# Altium project EEE20001 Lab Equipment.PrjPcb
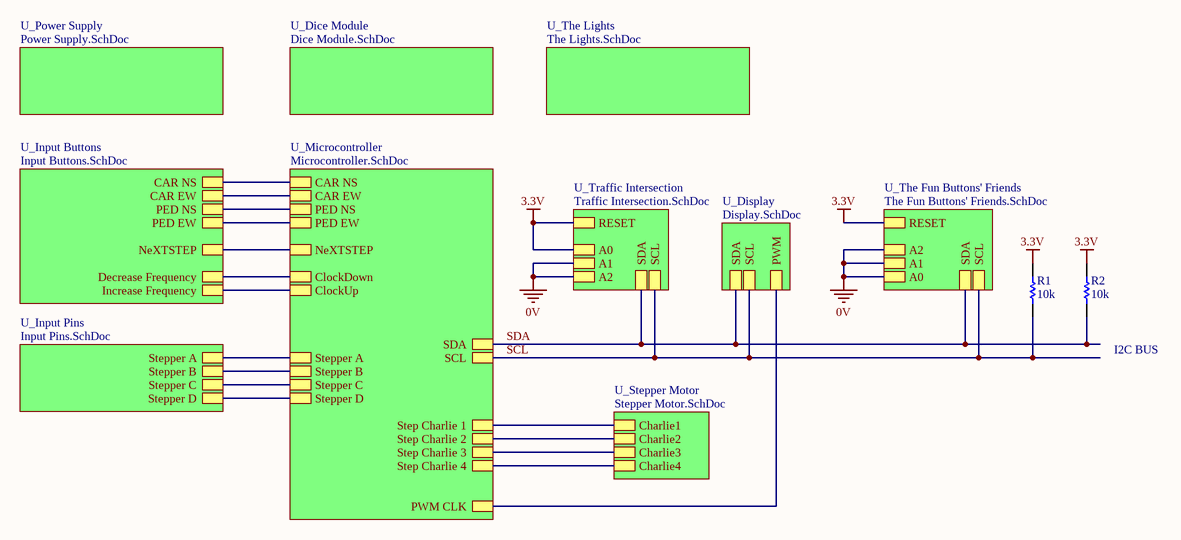
[diagram p0: 190822 Top Level.SchDoc]
11 sheets, 170 parts. Net scope: hierarchical (ports join the sheet entries above them; power ports are global).
Board file: 191015 PCB (REV0-1).PcbDoc
Sheets:
  190822 Top Level.SchDoc
    U_Power Supply = Power Supply.SchDoc
    U_Input Buttons = Input Buttons.SchDoc
    U_Input Pins = Input Pins.SchDoc
    U_Microcontroller = Microcontroller.SchDoc
    U_Traffic Intersection = Traffic Intersection.SchDoc
    U_Dice Module = Dice Module.SchDoc
    U_The Lights = The Lights.SchDoc
    U_Display = Display.SchDoc
    U_The Fun Buttons' Friends = The Fun Buttons' Friends.SchDoc
    U_Stepper Motor = Stepper Motor.SchDoc

## Sheet 190822 Top Level.SchDoc
size A4

### Parts
R1  10k  [0805]
R2  10k  [0805]

### Sub-sheets
U_Dice Module = Dice Module.SchDoc: no entries
U_Display = Display.SchDoc: SCL, SDA, PWM
U_Input Buttons = Input Buttons.SchDoc: CAR NS, CAR EW, PED NS, PED EW, NeXTSTEP, Decrease Frequency, Increase Frequency
U_Input Pins = Input Pins.SchDoc: Stepper D, Stepper C, Stepper B, Stepper A
U_Microcontroller = Microcontroller.SchDoc: SDA, SCL, CAR NS, CAR EW, PED NS, PED EW, Stepper A, Stepper B, Stepper C, Stepper D, Step Charlie 1, Step Charlie 2, Step Charlie 4, Step Charlie 3, PWM CLK, NeXTSTEP, ClockDown, ClockUp
U_Power Supply = Power Supply.SchDoc: no entries
U_Stepper Motor = Stepper Motor.SchDoc: Charlie1, Charlie2, Charlie3, Charlie4
U_The Fun Buttons' Friends = The Fun Buttons' Friends.SchDoc: SDA, SCL, RESET, A0, A1, A2
U_The Lights = The Lights.SchDoc: no entries
U_Traffic Intersection = Traffic Intersection.SchDoc: A0, A1, A2, RESET, SDA, SCL

### Nets
0V: sheet U_Traffic Intersection/A1, sheet U_Traffic Intersection/A2, sheet U_The Fun Buttons' Friends/A0, sheet U_The Fun Buttons' Friends/A1, sheet U_The Fun Buttons' Friends/A2
3.3V: R1.1 R2.1 ; sheet U_Traffic Intersection/A0, sheet U_Traffic Intersection/RESET, sheet U_The Fun Buttons' Friends/RESET
Charlie1: sheet U_Microcontroller/Step Charlie 1, sheet U_Stepper Motor/Charlie1
Charlie2: sheet U_Microcontroller/Step Charlie 2, sheet U_Stepper Motor/Charlie2
Charlie3: sheet U_Microcontroller/Step Charlie 3, sheet U_Stepper Motor/Charlie3
Charlie4: sheet U_Microcontroller/Step Charlie 4, sheet U_Stepper Motor/Charlie4
MISO: sheet U_Input Pins/Stepper C, sheet U_Microcontroller/Stepper C
MOSI: sheet U_Input Pins/Stepper D, sheet U_Microcontroller/Stepper D
SCL: R1.2 ; sheet U_Microcontroller/SCL, sheet U_Traffic Intersection/SCL, sheet U_Display/SCL, sheet U_The Fun Buttons' Friends/SCL
SDA: R2.2 ; sheet U_Microcontroller/SDA, sheet U_Traffic Intersection/SDA, sheet U_Display/SDA, sheet U_The Fun Buttons' Friends/SDA
Stepper A (IN): sheet U_Input Pins/Stepper A, sheet U_Microcontroller/Stepper A
Stepper B (IN): sheet U_Input Pins/Stepper B, sheet U_Microcontroller/Stepper B
NetBRUCE_SPRINGSTEEN1_1: sheet U_Input Buttons/Decrease Frequency, sheet U_Microcontroller/ClockDown
NetBRUCE_SPRINGSTEEN1_2: sheet U_Input Buttons/PED NS, sheet U_Microcontroller/PED NS
NetBRUCE_SPRINGSTEEN1_9: sheet U_Input Buttons/PED EW, sheet U_Microcontroller/PED EW
NetBRUCE_SPRINGSTEEN1_10: sheet U_Input Buttons/CAR NS, sheet U_Microcontroller/CAR NS
NetBRUCE_SPRINGSTEEN1_11: sheet U_Input Buttons/CAR EW, sheet U_Microcontroller/CAR EW
NetBRUCE_SPRINGSTEEN1_13: sheet U_Microcontroller/PWM CLK, sheet U_Display/PWM
NetBRUCE_SPRINGSTEEN1_30: sheet U_Input Buttons/NeXTSTEP, sheet U_Microcontroller/NeXTSTEP
NetBRUCE_SPRINGSTEEN1_32: sheet U_Input Buttons/Increase Frequency, sheet U_Microcontroller/ClockUp

### Notes on the sheet
- (near R2) I2C BUS
- Title
- Size:
- Date:
- A4
- Number:
- Time:
- Revision:
- Sheet
- of
- File:

### Library data of the parts
R1 R2 = RC0805FR0710KL: Manufacturer: YAGEO; Tolerance: 0.01; Rated Voltage: 0.125W; Part Number: RC0805FR0710KL; Value: 10k; Material: FR-07; qty: 50

## Sheet Power Supply.SchDoc
size A4
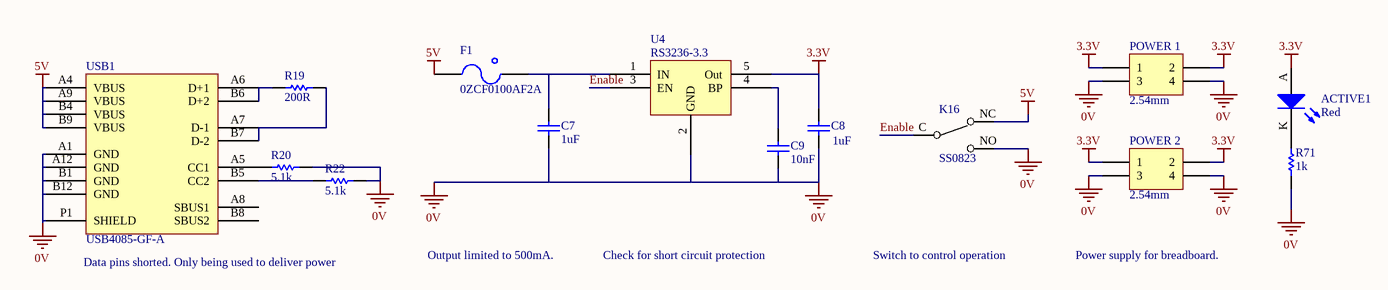
[diagram p1: Power Supply.SchDoc]

### Parts
ACTIVE1  Red  [0805 LED]
C7  1uF  [0805]
C8  1uF  [0805]
C9  10nF  [0805]
F1  0ZCF0100AF2A  [2920]
K16  SS0823  [Jaycar 2.54 SPDT Slide]
POWER_1  2.54mm  [Header 2x2]
POWER_2  2.54mm  [Header 2x2]
R19  200R  [0805]
R20  5.1k  [0805]
R22  5.1k  [0805]
R71  1k  [0805]
U4  RS3236-3.3  [Runic SOT-23-5]
USB1  USB4085-GF-A  [USB4085-GF-A]

### Nets
0V: C7.1 C8.1 C9.1 K16.NO POWER_1.3 POWER_1.4 POWER_2.3 POWER_2.4 R20.2 R22.2 R71.1 U4.2(GND) USB1.A1(GND) USB1.A12(GND) USB1.B1(GND) USB1.B12(GND) USB1.P1(SHIELD)
3.3V: ACTIVE1.A C8.2 POWER_1.1 POWER_1.2 POWER_2.1 POWER_2.2 U4.5(Out)
5V: F1.1 K16.NC USB1.A4(VBUS) USB1.A9(VBUS) USB1.B4(VBUS) USB1.B9(VBUS)
Enable: K16.C U4.3(EN)
NetACTIVE1_K: ACTIVE1.K R71.2
NetC7_2: C7.2 F1.2 U4.1(IN)
NetC9_2: C9.2 U4.4(BP)
NetR19_1: R19.1 USB1.A6(D+1) USB1.B6(D+2)
NetR19_2: R19.2 USB1.A7(D-1) USB1.B7(D-2)
NetR20_1: R20.1 USB1.A5(CC1)
NetR22_1: R22.1 USB1.B5(CC2)

Not connected (* = marked no-connect by the designer): USB1 A8(SBUS1) B8(SBUS2)

### Notes on the sheet
- (near USB1) Data pins shorted. Only being used to deliver power
- Output limited to 500mA.
- Check for short circuit protection
- Switch to control operation
- Power supply for breadboard.
- Title
- Size:
- Date:
- A4
- Number:
- Time:
- Revision:
- Sheet
- of
- File:

### Library data of the parts
ACTIVE1 = SML-210LTT86: Red LED Indication - Discrete 1.75V 0805 (2012 Metric); Manufacturer: ROHM Semiconductor; Part Number: SML-210LTT86; Colour: Red; Digikey Part Number: 511-1286-1-ND; Digikey Link: https://www.digikey.com/product-detail/en/rohm-semiconductor/SML-210LTT86/511-1286-1-ND/637099
C7 C8 = GCM21BR71A105KA37L: Manufacturer: muRata; Tolerance: 10%; Material: X7R; Rated Voltage: 10V; Part Number: GCM21BR71A105KA37L; Value: 1uF
C9 = GCM21BR71H103KA37L: Manufacturer: muRata; Tolerance: 10%; Material: X7R; Rated Voltage: 50V; Part Number: GCM21BR71H103KA37L; Value: 10nF
F1 = 0ZCF0100AF2A: PTC RESET FUSE 60V 1A 292; Manufacturer: Littelfuse Inc.; Part Number: 0ZCF0100AF2A; Digikey Part Number: 507-2070-1-ND; Digikey Link: https://www.digikey.com/product-detail/en/bel-fuse-inc/0ZCF0100AF2A/507-2070-1-ND/6210547
K16 = SS0823: SPDT Switch; Manufacturer: Jaycar; Part Number: SS0823; Digikey Link: https://www.jaycar.com.au/sub-miniature-dpdt-pcb-mount-switch/p/SS0823
POWER_1 POWER_2 = Header 2x2: Positions: 4; Angle: 0; Flange: No; Contact: NA; Part Number: Header 2x2; Pitch: 2.54mm; Row Spacing: 2.54mm
R19 = RC0805FR07200RL: Manufacturer: YAGEO; Tolerance: 0.01; Rated Voltage: 0.125W; Part Number: RC0805FR07200RL; Value: 200R; Material: FR-07; qty: 50
R20 R22 = RC0805FR075K1L: Manufacturer: YAGEO; Tolerance: 0.01; Rated Voltage: 0.125W; Part Number: RC0805FR075K1L; Value: 5.1k; Material: FR-07; qty: 50
R71 = RC0805FR071KL: Manufacturer: YAGEO; Tolerance: 0.01; Rated Voltage: 0.125W; Part Number: RC0805FR071KL; Value: 1k; Material: FR-07; qty: 50
U4 = RS3236-3.3: Low Power, Low Dropout, 500mA RF LinearRegulators; Manufacturer: RUNIC; Part Number: RS3236-3.3; Digikey Link: http://www.run-ic.com/Public/attached/file/201811/1542246949_88491.pdf
USB1 = USB4085-GF-A: USB - C (Type - C) USB 2.0 Receptacle Connector 16 Position Through Hole, Right Angle; Angle: 90; Part Number: USB4085-GF-A; Digikey Part Number: 2073-USB4085-GF-ACT-ND; Digikey Link: https://www.digikey.ee/product-detail/en/gct/USB4085-GF-A/2073-USB4085-GF-ACT-ND/9859733

## Sheet Input Buttons.SchDoc
size A4
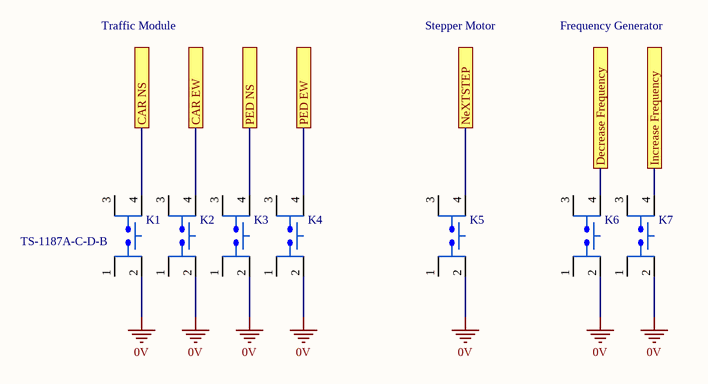
[diagram p2: Input Buttons.SchDoc]

### Parts
K1  TS-1187A-C-D-B  [XKB SW-4.5]
K2  TS-1187A-C-D-B  [XKB SW-4.5]  (value not drawn)
K3  TS-1187A-C-D-B  [XKB SW-4.5]  (value not drawn)
K4  TS-1187A-C-D-B  [XKB SW-4.5]  (value not drawn)
K5  TS-1187A-C-D-B  [XKB SW-4.5]  (value not drawn)
K6  TS-1187A-C-D-B  [XKB SW-4.5]  (value not drawn)
K7  TS-1187A-C-D-B  [XKB SW-4.5]  (value not drawn)

### Ports
CAR EW, CAR NS, Decrease Frequency, Increase Frequency, NeXTSTEP, PED EW, PED NS

### Nets
0V: K1.2(VDD) K2.2(VDD) K3.2(VDD) K4.2(VDD) K5.2(VDD) K6.2(VDD) K7.2(VDD)
NetBRUCE_SPRINGSTEEN1_1: K6.4(VDD) ; port Decrease Frequency
NetBRUCE_SPRINGSTEEN1_2: K3.4(VDD) ; port PED NS
NetBRUCE_SPRINGSTEEN1_9: K4.4(VDD) ; port PED EW
NetBRUCE_SPRINGSTEEN1_10: K1.4(VDD) ; port CAR NS
NetBRUCE_SPRINGSTEEN1_11: K2.4(VDD) ; port CAR EW
NetBRUCE_SPRINGSTEEN1_30: K5.4(VDD) ; port NeXTSTEP
NetBRUCE_SPRINGSTEEN1_32: K7.4(VDD) ; port Increase Frequency

Not connected (* = marked no-connect by the designer): K1 1(VDD) 3(VDD); K2 1(VDD) 3(VDD); K3 1(VDD) 3(VDD); K4 1(VDD) 3(VDD); K5 1(VDD) 3(VDD); K6 1(VDD) 3(VDD); K7 1(VDD) 3(VDD)

### Notes on the sheet
- Traffic Module
- Stepper Motor
- Frequency Generator
- Title
- Size:
- Date:
- A4
- Number:
- Time:
- Revision:
- Sheet
- of
- File:

### Library data of the parts
K1-K7 = TS-1187A-C-D-B: TACTILE SWITCHES SPST 5.10MM X 5.10MM 0.80MM SMD ROHS; Manufacturer: XKB Enerprise; Part Number: TS-1187A-C-D-B; Digikey Link: https://jlcpcb.com/client/index.html#/parts/componentSearch?searchTxt=usb

## Sheet Input Pins.SchDoc
size A4
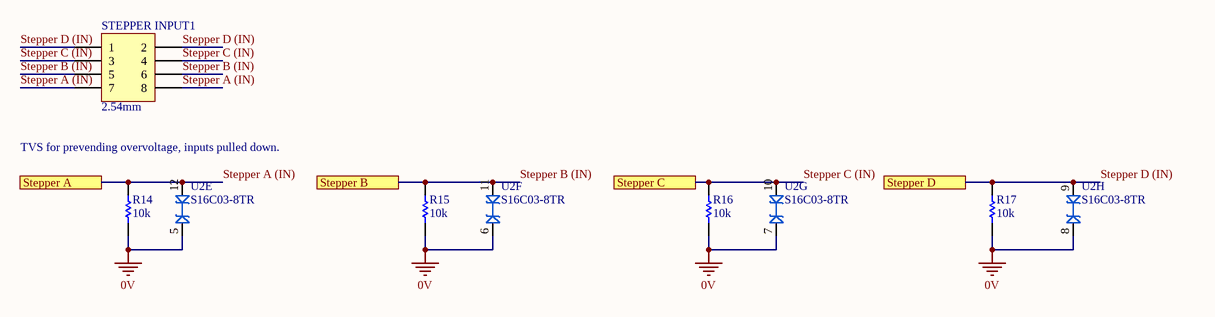
[diagram p3: Input Pins.SchDoc]

### Parts
R14  10k  [0805]
R15  10k  [0805]
R16  10k  [0805]
R17  10k  [0805]
STEPPER_INPUT1  2.54mm  [Header 2x4]
U2  S16C03-8TR  [SMC 16-SOIC]  (parts E,F,G,H of 8)

### Ports
Stepper A, Stepper B, Stepper C, Stepper D

### Nets
0V: R14.1 R15.1 R16.1 R17.1 U2.5(A) U2.6(A) U2.7(A) U2.8(A)
Stepper A (IN): R14.2 STEPPER_INPUT1.7 STEPPER_INPUT1.8 U2.12(A) ; port Stepper A
Stepper B (IN): R15.2 STEPPER_INPUT1.5 STEPPER_INPUT1.6 U2.11(A) ; port Stepper B
Stepper C (IN): R16.2 STEPPER_INPUT1.3 STEPPER_INPUT1.4 U2.10(A) ; port Stepper C  [project net MISO]
Stepper D (IN): R17.2 STEPPER_INPUT1.1 STEPPER_INPUT1.2 U2.9(A) ; port Stepper D  [project net MOSI]

### Notes on the sheet
- TVS for prevending overvoltage, inputs pulled down.
- Title
- Size:
- Date:
- A4
- Number:
- Time:
- Revision:
- Sheet
- of
- File:

### Library data of the parts
R14-R17 = RC0805FR0710KL: as R1 on sheet 190822 Top Level; Part Number: RC0805FR0710KL; Value: 10k; Material: FR-07; qty: 50
STEPPER_INPUT1 = Header 2x4: Positions: 8; Angle: 0; Flange: No; Contact: NA; Part Number: Header 2x4; Pitch: 2.54mm; Row Spacing: 2.54mm
U2 = S16C03-8TR: PD 300W VWM 3.3VCJ 425PFPACKAGE; Manufacturer: SMC Diode; Part Number: S16C03-8TR; Digikey Part Number: 1655-2152-2-ND; Digikey Link: https://www.digikey.com/product-detail/en/smc-diode-solutions/S16C03-8TR/1655-2152-2-ND/9816814

## Sheet Microcontroller.SchDoc
size A4
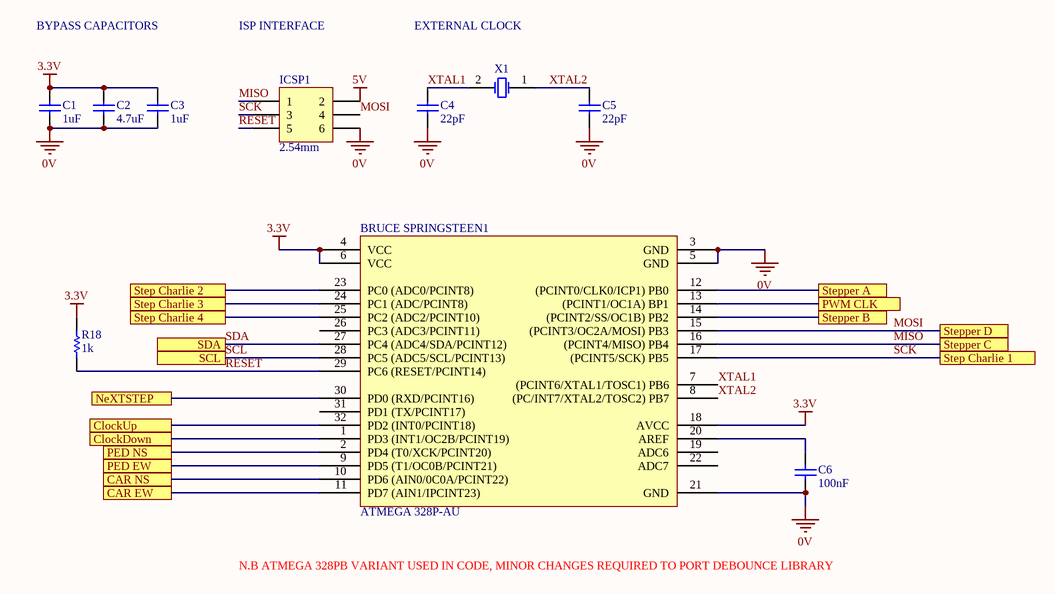
[diagram p4: Microcontroller.SchDoc]

### Parts
BRUCE_SPRINGSTEEN1  ATMEGA 328P-AU  [ATMEL TQFP-32]
C1  1uF  [0805]
C2  4.7uF  [0805]
C3  1uF  [0805]
C4  22pF  [0805]
C5  22pF  [0805]
C6  100nF  [0805]
ICSP1  2.54mm  [Header 2x3]
R18  1k  [0805]
X1  (no value)  [Abracon HC-49/US]

### Ports
CAR EW, CAR NS, ClockDown, ClockUp, NeXTSTEP, PED EW, PED NS, PWM CLK, SCL, SDA, Step Charlie 1, Step Charlie 2, Step Charlie 3, Step Charlie 4, Stepper A, Stepper B, Stepper C, Stepper D

### Nets
0V: BRUCE_SPRINGSTEEN1.3(GND) BRUCE_SPRINGSTEEN1.5(GND) BRUCE_SPRINGSTEEN1.21(GND) C1.1 C2.1 C3.1 C4.1 C5.1 C6.1 ICSP1.6
3.3V: BRUCE_SPRINGSTEEN1.4(VCC) BRUCE_SPRINGSTEEN1.6(VCC) BRUCE_SPRINGSTEEN1.18(AVCC) C1.2 C2.2 C3.2 R18.2
5V: ICSP1.2
Charlie2: BRUCE_SPRINGSTEEN1.23(PC0_(ADC0/PCINT8)) ; port Step Charlie 2
Charlie3: BRUCE_SPRINGSTEEN1.24(PC1_(ADC/PCINT8)) ; port Step Charlie 3
Charlie4: BRUCE_SPRINGSTEEN1.25(PC2_(ADC2/PCINT10)) ; port Step Charlie 4
MISO: BRUCE_SPRINGSTEEN1.16((PCINT4/MISO)_PB4) ICSP1.1 ; port Stepper C
MOSI: BRUCE_SPRINGSTEEN1.15((PCINT3/OC2A/MOSI)_PB3) ICSP1.4 ; port Stepper D
RESET: BRUCE_SPRINGSTEEN1.29(PC6_(RESET/PCINT14)) ICSP1.5 R18.1
SCK: BRUCE_SPRINGSTEEN1.17((PCINT5/SCK)_PB5) ICSP1.3 ; port Step Charlie 1  [project net Charlie1]
SCL: BRUCE_SPRINGSTEEN1.28(PC5_(ADC5/SCL/PCINT13)) ; port SCL
SDA: BRUCE_SPRINGSTEEN1.27(PC4_(ADC4/SDA/PCINT12)) ; port SDA
Stepper A (IN): BRUCE_SPRINGSTEEN1.12((PCINT0/CLK0/ICP1)_PB0) ; port Stepper A
Stepper B (IN): BRUCE_SPRINGSTEEN1.14((PCINT2/SS/OC1B)_PB2) ; port Stepper B
XTAL1: BRUCE_SPRINGSTEEN1.7((PCINT6/XTAL1/TOSC1)_PB6) C4.2 X1.2(OSC2)
XTAL2: BRUCE_SPRINGSTEEN1.8((PC/INT7/XTAL2/TOSC2)_PB7) C5.2 X1.1(OSC1)
NetBRUCE_SPRINGSTEEN1_1: BRUCE_SPRINGSTEEN1.1(PD3_(INT1/OC2B/PCINT19)) ; port ClockDown
NetBRUCE_SPRINGSTEEN1_2: BRUCE_SPRINGSTEEN1.2(PD4_(T0/XCK/PCINT20)) ; port PED NS
NetBRUCE_SPRINGSTEEN1_9: BRUCE_SPRINGSTEEN1.9(PD5_(T1/OC0B/PCINT21)) ; port PED EW
NetBRUCE_SPRINGSTEEN1_10: BRUCE_SPRINGSTEEN1.10(PD6_(AIN0/0C0A/PCINT22)) ; port CAR NS
NetBRUCE_SPRINGSTEEN1_11: BRUCE_SPRINGSTEEN1.11(PD7_(AIN1/IPCINT23)) ; port CAR EW
NetBRUCE_SPRINGSTEEN1_13: BRUCE_SPRINGSTEEN1.13((PCINT1/OC1A)_BP1) ; port PWM CLK
NetBRUCE_SPRINGSTEEN1_20: BRUCE_SPRINGSTEEN1.20(AREF) C6.2
NetBRUCE_SPRINGSTEEN1_30: BRUCE_SPRINGSTEEN1.30(PD0_(RXD/PCINT16)) ; port NeXTSTEP
NetBRUCE_SPRINGSTEEN1_32: BRUCE_SPRINGSTEEN1.32(PD2_(INT0/PCINT18)) ; port ClockUp

Not connected (* = marked no-connect by the designer): BRUCE_SPRINGSTEEN1 19(ADC6) 22(ADC7) 26(PC3_(ADC3/PCINT11)) 31(PD1_(TX/PCINT17))

### Notes on the sheet
- BYPASS CAPACITORS
- ISP INTERFACE
- EXTERNAL CLOCK
- N.B ATMEGA 328PB VARIANT USED IN CODE, MINOR CHANGES REQUIRED TO PORT DEBOUNCE LIBRARY
- Title
- Size:
- Date:
- A4
- Number:
- Time:
- Revision:
- Sheet
- of
- File:

### Library data of the parts
BRUCE_SPRINGSTEEN1 = ATMEGA 328P-AU: AVR AVR® ATmega Microcontroller IC 8-Bit 20MHz 32KB (16K x 16) FLASH 32-TQFP (7x7); Manufacturer: ATMEL; Part Number: ATMEGA 328P-AU; Digikey Part Number: ATMEGA328P-AU-ND; Digikey Link: https://www.digikey.com/product-detail/en/microchip-technology/ATMEGA328P-AU/ATMEGA328P-AU-ND/1832260
C1 C3 = GCM21BR71A105KA37L: as C7 on sheet Power Supply; Part Number: GCM21BR71A105KA37L; Value: 1uF
C2 = GCM21BR61A475KA37L: Manufacturer: muRata; Tolerance: 10%; Material: X5R; Rated Voltage: 10V; Part Number: GCM21BR61A475KA37L; Value: 4.7uF
C4 C5 = GCM21B5C1H220JA37L: Manufacturer: muRata; Tolerance: 5%; Material: C0G; Rated Voltage: 50V; Part Number: GCM21B5C1H220JA37L; Value: 22pF
C6 = GCM21BR71E104KA37L: Manufacturer: muRata; Tolerance: 10%; Material: X7R; Rated Voltage: 25V; Part Number: GCM21BR71E104KA37L; Value: 100nF
ICSP1 = Header 2x3: Positions: 6; Angle: 0; Flange: No; Contact: NA; Part Number: Header 2x3; Pitch: 2.54mm; Row Spacing: 2.54mm
R18 = RC0805FR071KL: as R71 on sheet Power Supply; Part Number: RC0805FR071KL; Value: 1k; Material: FR-07; qty: 50
X1 = ABLS-16.000MHZ-B4-T: Manufacturer: Abracon LLC; Load Capacitance: 18pF; ESR: 40R; Part Number: ABLS-16.000MHZ-B4-T; Digikey Part Number: 535-10226-1-ND; Digikey Link: https://www.digikey.com/product-detail/en/abracon-llc/ABLS-16.000MHZ-B4-T/535-10226-1-ND/2184261

## Sheet Traffic Intersection.SchDoc
size A4
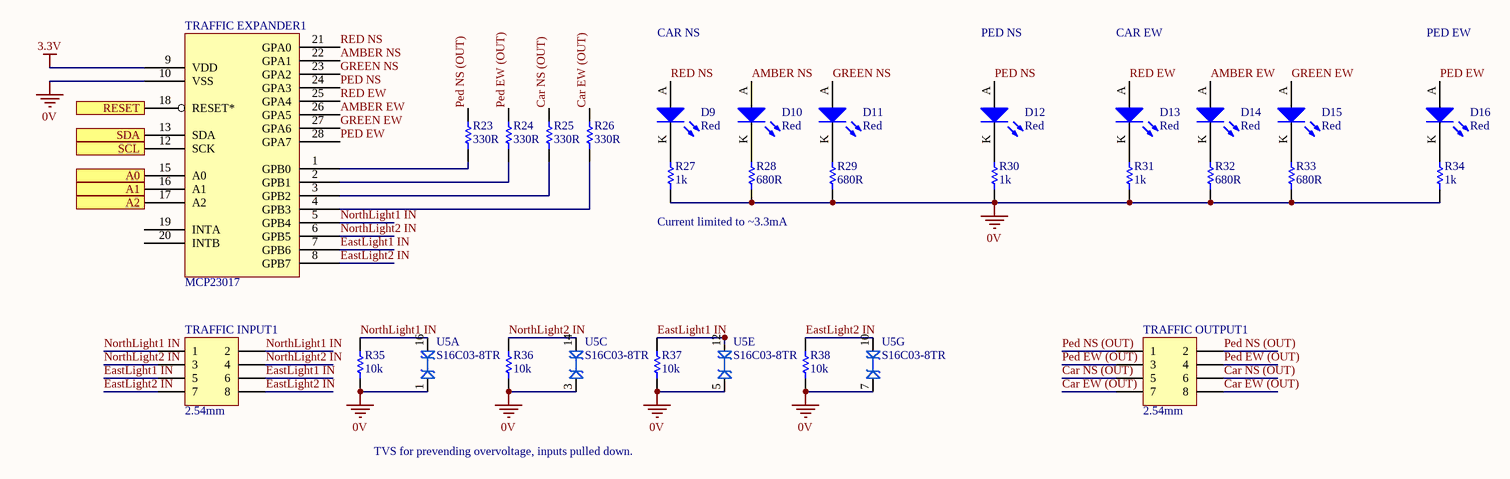
[diagram p5: Traffic Intersection.SchDoc]

### Parts
D9  Red  [0805 LED]
D10  Red  [0805 LED]
D11  Red  [0805 LED]
D12  Red  [0805 LED]
D13  Red  [0805 LED]
D14  Red  [0805 LED]
D15  Red  [0805 LED]
D16  Red  [0805 LED]
R23  330R  [0805]
R24  330R  [0805]
R25  330R  [0805]
R26  330R  [0805]
R27  1k  [0805]
R28  680R  [0805]
R29  680R  [0805]
R30  1k  [0805]
R31  1k  [0805]
R32  680R  [0805]
R33  680R  [0805]
R34  1k  [0805]
R35  10k  [0805]
R36  10k  [0805]
R37  10k  [0805]
R38  10k  [0805]
TRAFFIC_EXPANDER1  MCP23017  [Microchip 28-SOIC]
TRAFFIC_INPUT1  2.54mm  [Header 2x4]
TRAFFIC_OUTPUT1  2.54mm  [Header 2x4]
U5  S16C03-8TR  [SMC 16-SOIC]  (parts A,C,E,G of 8)

### Ports
A0, A1, A2, RESET, SCL, SDA

### Nets
0V: R27.1 R28.1 R29.1 R30.1 R31.1 R32.1 R33.1 R34.1 R35.1 R36.1 R37.1 R38.1 TRAFFIC_EXPANDER1.10(VSS) TRAFFIC_EXPANDER1.16(A1) TRAFFIC_EXPANDER1.17(A2) U5.1(A) U5.3(A) U5.5(A) U5.7(A) ; port A1, port A2
3.3V: TRAFFIC_EXPANDER1.9(VDD) TRAFFIC_EXPANDER1.15(A0) TRAFFIC_EXPANDER1.18(RESET*) ; port A0, port RESET
AMBER EW: D14.A TRAFFIC_EXPANDER1.26(GPA5)
AMBER NS: D10.A TRAFFIC_EXPANDER1.22(GPA1)
Car EW (OUT): R26.2 TRAFFIC_OUTPUT1.7 TRAFFIC_OUTPUT1.8
Car NS (OUT): R25.2 TRAFFIC_OUTPUT1.5 TRAFFIC_OUTPUT1.6
EastLight1 IN: R37.2 TRAFFIC_EXPANDER1.7(GPB6) TRAFFIC_INPUT1.5 TRAFFIC_INPUT1.6 U5.12(A)
EastLight2 IN: R38.2 TRAFFIC_EXPANDER1.8(GPB7) TRAFFIC_INPUT1.7 TRAFFIC_INPUT1.8 U5.10(A)
GREEN EW: D15.A TRAFFIC_EXPANDER1.27(GPA6)
GREEN NS: D11.A TRAFFIC_EXPANDER1.23(GPA2)
NorthLight1 IN: R35.2 TRAFFIC_EXPANDER1.5(GPB4) TRAFFIC_INPUT1.1 TRAFFIC_INPUT1.2 U5.16(A)
NorthLight2 IN: R36.2 TRAFFIC_EXPANDER1.6(GPB5) TRAFFIC_INPUT1.3 TRAFFIC_INPUT1.4 U5.14(A)
PED EW: D16.A TRAFFIC_EXPANDER1.28(GPA7)
Ped EW (OUT): R24.2 TRAFFIC_OUTPUT1.3 TRAFFIC_OUTPUT1.4
PED NS: D12.A TRAFFIC_EXPANDER1.24(GPA3)
Ped NS (OUT): R23.2 TRAFFIC_OUTPUT1.1 TRAFFIC_OUTPUT1.2
RED EW: D13.A TRAFFIC_EXPANDER1.25(GPA4)
RED NS: D9.A TRAFFIC_EXPANDER1.21(GPA0)
SCL: TRAFFIC_EXPANDER1.12(SCK) ; port SCL
SDA: TRAFFIC_EXPANDER1.13(SDA) ; port SDA
NetD9_K: D9.K R27.2
NetD10_K: D10.K R28.2
NetD11_K: D11.K R29.2
NetD12_K: D12.K R30.2
NetD13_K: D13.K R31.2
NetD14_K: D14.K R32.2
NetD15_K: D15.K R33.2
NetD16_K: D16.K R34.2
NetR23_1: R23.1 TRAFFIC_EXPANDER1.1(GPB0)
NetR24_1: R24.1 TRAFFIC_EXPANDER1.2(GPB1)
NetR25_1: R25.1 TRAFFIC_EXPANDER1.3(GPB2)
NetR26_1: R26.1 TRAFFIC_EXPANDER1.4(GPB3)

Not connected (* = marked no-connect by the designer): TRAFFIC_EXPANDER1 19(INTA) 20(INTB)

### Notes on the sheet
- CAR NS
- PED NS
- CAR EW
- PED EW
- Current limited to ~3.3mA
- TVS for prevending overvoltage, inputs pulled down.
- Title
- Size:
- Date:
- A4
- Number:
- Time:
- Revision:
- Sheet
- of
- File:

### Library data of the parts
D9 D13 = SML-210LTT86: as ACTIVE1 on sheet Power Supply; Part Number: SML-210LTT86; Colour: Red; Digikey Part Number: 511-1286-1-ND; Digikey Link: https://www.digikey.com/product-detail/en/rohm-semiconductor/SML-210LTT86/511-1286-1-ND/637099
D10 D14 = SML-211DTT86: Orange LED Indication - Discrete 1.75V 0805 (2012 Metric); Manufacturer: ROHM Semiconductor; Part Number: SML-211DTT86; Colour: Red; Digikey Part Number: 511-1291-1-ND; Digikey Link: https://www.digikey.com/product-detail/en/rohm-semiconductor/SML-211DTT86/511-1291-1-ND/637104
D11 D12 D15 D16 = SML-210FTT86: Green LED Indication - Discrete 1.75V 0805 (2012 Metric); Manufacturer: ROHM Semiconductor; Part Number: SML-210FTT86; Colour: Red; Digikey Part Number: 511-1285-1-ND; Digikey Link: https://www.digikey.com/product-detail/en/rohm-semiconductor/SML-210FTT86/511-1285-1-ND/637098
R23-R26 = RC0805FR07330RL: Manufacturer: YAGEO; Tolerance: 0.01; Rated Voltage: 0.125W; Part Number: RC0805FR07330RL; Value: 330R; Material: FR-07; qty: 50
R27 R30 R31 R34 = RC0805FR071KL: as R71 on sheet Power Supply; Part Number: RC0805FR071KL; Value: 1k; Material: FR-07; qty: 50
R28 R29 R32 R33 = RC0805FR07680RL: Manufacturer: YAGEO; Tolerance: 0.01; Rated Voltage: 0.125W; Part Number: RC0805FR07680RL; Value: 680R; Material: FR-07; qty: 50
R35-R38 = RC0805FR0710KL: as R1 on sheet 190822 Top Level; Part Number: RC0805FR0710KL; Value: 10k; Material: FR-07; qty: 50
TRAFFIC_EXPANDER1 = MCP23017: IC I/O EXPANDER I2C 16B 28SOIC; Manufacturer: Microchip Technology; Part Number: MCP23017; Digikey Part Number: MCP23017T-E/SOTR-ND; Digikey Link: https://www.digikey.com/product-detail/en/microchip-technology/MCP23017T-E-SO/MCP23017T-E-SOTR-ND/964184
TRAFFIC_INPUT1 TRAFFIC_OUTPUT1 = Header 2x4: as STEPPER_INPUT1 on sheet Input Pins; Part Number: Header 2x4; Pitch: 2.54mm; Row Spacing: 2.54mm
U5 = S16C03-8TR: as U2 on sheet Input Pins; Part Number: S16C03-8TR; Digikey Part Number: 1655-2152-2-ND; Digikey Link: https://www.digikey.com/product-detail/en/smc-diode-solutions/S16C03-8TR/1655-2152-2-ND/9816814

## Sheet Dice Module.SchDoc
size A4
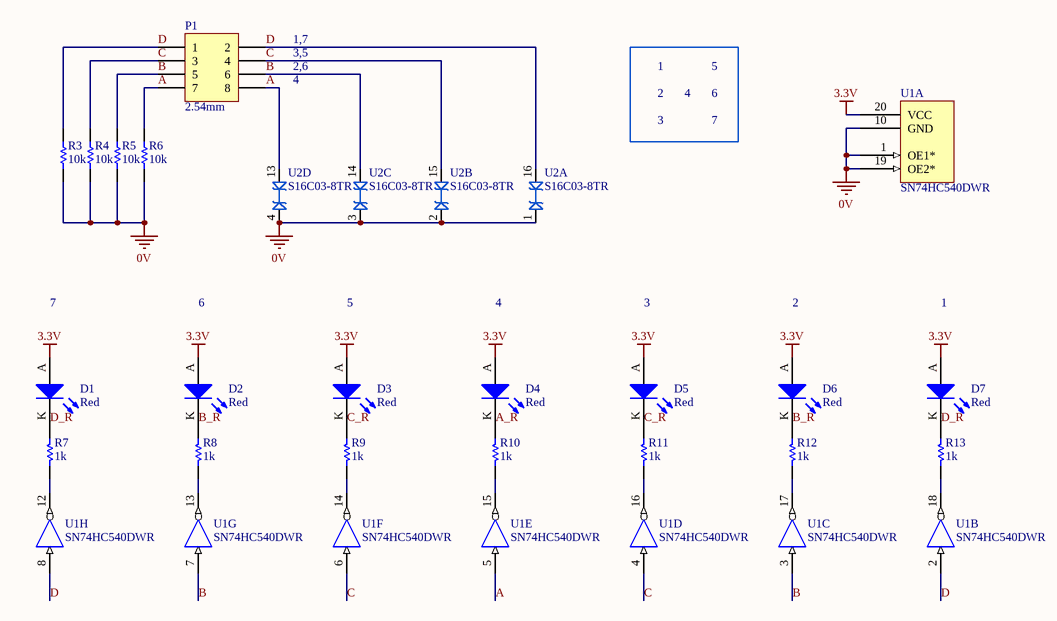
[diagram p6: Dice Module.SchDoc]

### Parts
D1  Red  [0805 LED]
D2  Red  [0805 LED]
D3  Red  [0805 LED]
D4  Red  [0805 LED]
D5  Red  [0805 LED]
D6  Red  [0805 LED]
D7  Red  [0805 LED]
P1  2.54mm  [Header 2x4]
R3  10k  [0805]
R4  10k  [0805]
R5  10k  [0805]
R6  10k  [0805]
R7  1k  [0805]
R8  1k  [0805]
R9  1k  [0805]
R10  1k  [0805]
R11  1k  [0805]
R12  1k  [0805]
R13  1k  [0805]
U1  SN74HC540DWR  [TI 20-SOIC]  (parts A,B,C,D,E,F,G,H of 9)
U2  S16C03-8TR  [SMC 16-SOIC]  (parts A,B,C,D of 8)

### Nets
0V: R3.1 R4.1 R5.1 R6.1 U1.1(OE1*) U1.10(GND) U1.19(OE2*) U2.1(A) U2.2(A) U2.3(A) U2.4(A)
3.3V: D1.A D2.A D3.A D4.A D5.A D6.A D7.A U1.20(VCC)
A: P1.7 P1.8 R6.2 U1.5(A4) U2.13(A)
A_R: D4.K R10.1
B: P1.5 P1.6 R5.2 U1.3(A2) U1.7(A6) U2.14(A)
B_R: D2.K D6.K R8.1 R12.1
C: P1.3 P1.4 R4.2 U1.4(A3) U1.6(A5) U2.15(A)
C_R: D3.K D5.K R9.1 R11.1
D: P1.1 P1.2 R3.2 U1.2(A1) U1.8(A7) U2.16(A)
D_R: D1.K D7.K R7.1 R13.1
NetR7_2: R7.2 U1.12(Y7)
NetR8_2: R8.2 U1.13(Y6)
NetR9_2: R9.2 U1.14(Y5)
NetR10_2: R10.2 U1.15(Y5)
NetR11_2: R11.2 U1.16(Y3)
NetR12_2: R12.2 U1.17(Y2)
NetR13_2: R13.2 U1.18(Y1)

### Notes on the sheet
- 1,7
- 3,5
- 2,6
- 4
- 1
- 2
- 5
- 6
- 3
- 7
- Title
- Size:
- Date:
- A4
- Number:
- Time:
- Revision:
- Sheet
- of
- File:

### Library data of the parts
D1-D7 = SML-210LTT86: as ACTIVE1 on sheet Power Supply; Part Number: SML-210LTT86; Colour: Red; Digikey Part Number: 511-1286-1-ND; Digikey Link: https://www.digikey.com/product-detail/en/rohm-semiconductor/SML-210LTT86/511-1286-1-ND/637099
P1 = Header 2x4: as STEPPER_INPUT1 on sheet Input Pins; Part Number: Header 2x4; Pitch: 2.54mm; Row Spacing: 2.54mm
R3-R6 = RC0805FR0710KL: as R1 on sheet 190822 Top Level; Part Number: RC0805FR0710KL; Value: 10k; Material: FR-07; qty: 50
R7-R13 = RC0805FR071KL: as R71 on sheet Power Supply; Part Number: RC0805FR071KL; Value: 1k; Material: FR-07; qty: 50
U1 = SN74HC540DWR: IC BUFFER INVERT 6V 20SOIC; Manufacturer: Texas Instruments; Part Number: SN74HC540DWR; Digikey Part Number: 296-8333-1-ND; Digikey Link: https://www.digikey.com/product-detail/en/texas-instruments/SN74HC540DWR/296-8333-1-ND/376710
U2 = S16C03-8TR: as U2 on sheet Input Pins; Part Number: S16C03-8TR; Digikey Part Number: 1655-2152-2-ND; Digikey Link: https://www.digikey.com/product-detail/en/smc-diode-solutions/S16C03-8TR/1655-2152-2-ND/9816814

## Sheet The Lights.SchDoc
size A4
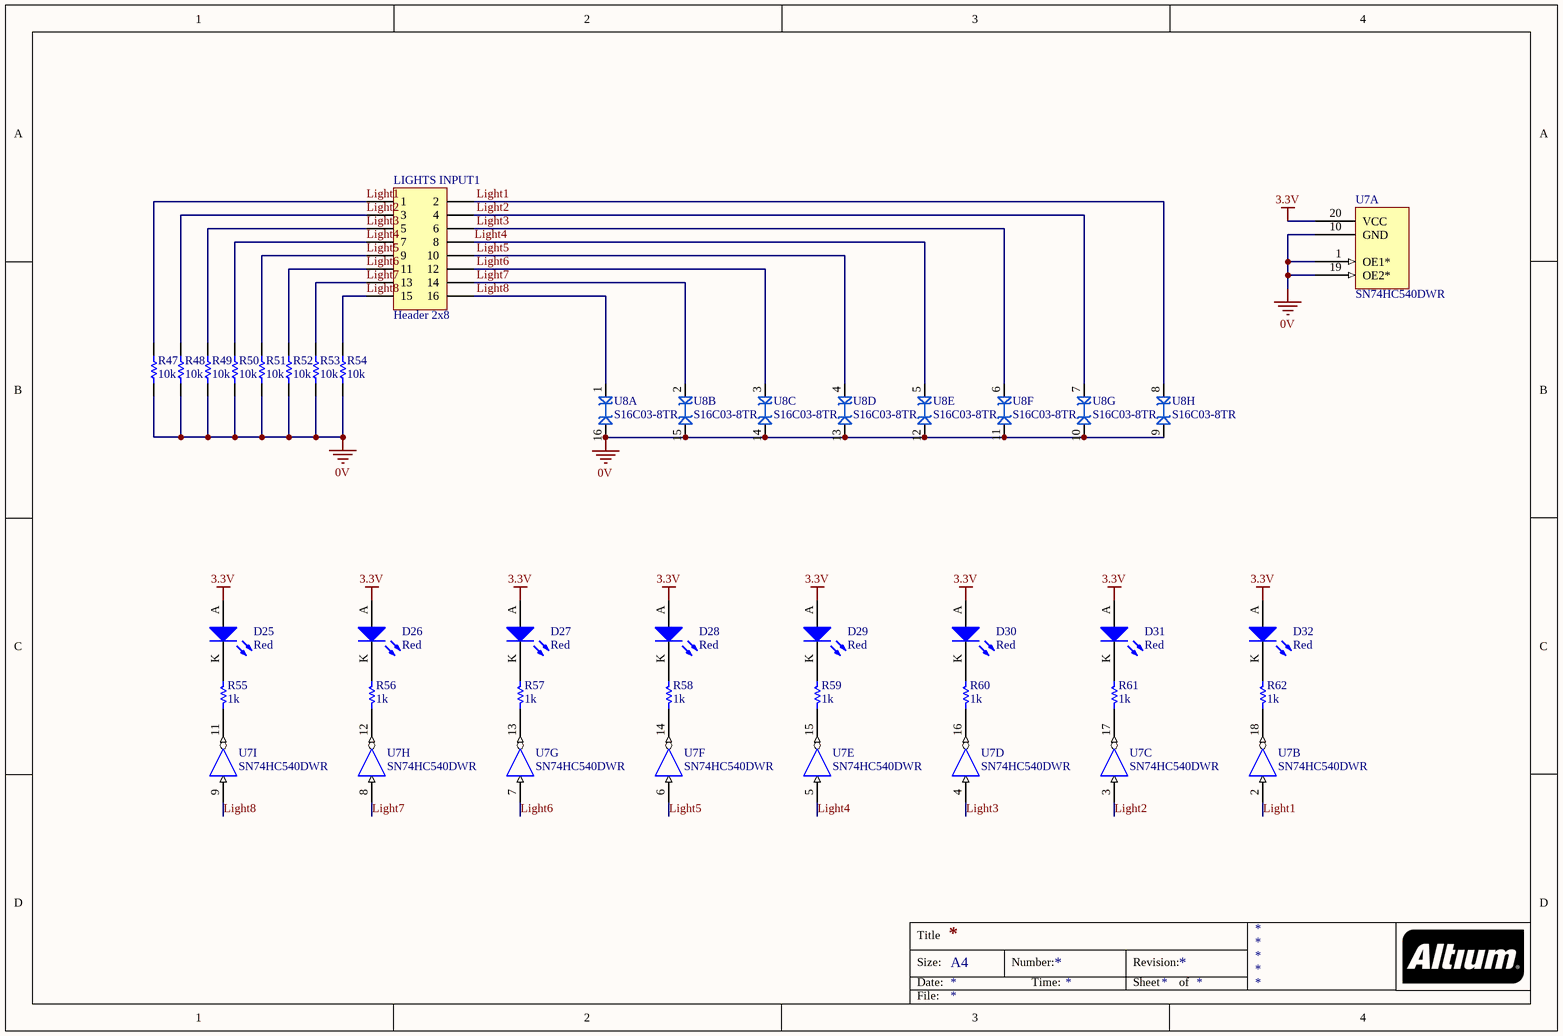
[diagram p7: The Lights.SchDoc]

### Parts
D25  Red  [0805 LED]
D26  Red  [0805 LED]
D27  Red  [0805 LED]
D28  Red  [0805 LED]
D29  Red  [0805 LED]
D30  Red  [0805 LED]
D31  Red  [0805 LED]
D32  Red  [0805 LED]
LIGHTS_INPUT1  Header 2x8  [Header 2x8]
R47  10k  [0805]
R48  10k  [0805]
R49  10k  [0805]
R50  10k  [0805]
R51  10k  [0805]
R52  10k  [0805]
R53  10k  [0805]
R54  10k  [0805]
R55  1k  [0805]
R56  1k  [0805]
R57  1k  [0805]
R58  1k  [0805]
R59  1k  [0805]
R60  1k  [0805]
R61  1k  [0805]
R62  1k  [0805]
U7  SN74HC540DWR  [TI 20-SOIC]  (parts A,B,C,D,E,F,G,H,I of 9)
U8  S16C03-8TR  [SMC 16-SOIC]  (parts A,B,C,D,E,F,G,H of 8)

### Nets
0V: R47.1 R48.1 R49.1 R50.1 R51.1 R52.1 R53.1 R54.1 U7.1(OE1*) U7.10(GND) U7.19(OE2*) U8.9(A) U8.10(A) U8.11(A) U8.12(A) U8.13(A) U8.14(A) U8.15(A) U8.16(A)
3.3V: D25.A D26.A D27.A D28.A D29.A D30.A D31.A D32.A U7.20(VCC)
Light1: LIGHTS_INPUT1.1 LIGHTS_INPUT1.2 R47.2 U7.2(A1) U8.8(A)
Light2: LIGHTS_INPUT1.3 LIGHTS_INPUT1.4 R48.2 U7.3(A2) U8.7(A)
Light3: LIGHTS_INPUT1.5 LIGHTS_INPUT1.6 R49.2 U7.4(A3) U8.6(A)
Light4: LIGHTS_INPUT1.7 LIGHTS_INPUT1.8 R50.2 U7.5(A4) U8.5(A)
Light5: LIGHTS_INPUT1.9 LIGHTS_INPUT1.10 R51.2 U7.6(A5) U8.4(A)
Light6: LIGHTS_INPUT1.11 LIGHTS_INPUT1.12 R52.2 U7.7(A6) U8.3(A)
Light7: LIGHTS_INPUT1.13 LIGHTS_INPUT1.14 R53.2 U7.8(A7) U8.2(A)
Light8: LIGHTS_INPUT1.15 LIGHTS_INPUT1.16 R54.2 U7.9(A8) U8.1(A)
NetD25_K: D25.K R55.1
NetD26_K: D26.K R56.1
NetD27_K: D27.K R57.1
NetD28_K: D28.K R58.1
NetD29_K: D29.K R59.1
NetD30_K: D30.K R60.1
NetD31_K: D31.K R61.1
NetD32_K: D32.K R62.1
NetR55_2: R55.2 U7.11(Y8)
NetR56_2: R56.2 U7.12(Y7)
NetR57_2: R57.2 U7.13(Y6)
NetR58_2: R58.2 U7.14(Y5)
NetR59_2: R59.2 U7.15(Y5)
NetR60_2: R60.2 U7.16(Y3)
NetR61_2: R61.2 U7.17(Y2)
NetR62_2: R62.2 U7.18(Y1)

### Notes on the sheet
- Title
- Size:
- Date:
- A4
- Number:
- Time:
- Revision:
- Sheet
- of
- File:

### Library data of the parts
D25-D32 = SML-210LTT86: as ACTIVE1 on sheet Power Supply; Part Number: SML-210LTT86; Colour: Red; Digikey Part Number: 511-1286-1-ND; Digikey Link: https://www.digikey.com/product-detail/en/rohm-semiconductor/SML-210LTT86/511-1286-1-ND/637099
LIGHTS_INPUT1 = Header 2x8: Positions: 16; Pitch: 2.54mm; Angle: 0; Flange: No; Contact: NA; Part Number: Header 2x8; Row Spacing: 2.54mm
R47-R54 = RC0805FR0710KL: as R1 on sheet 190822 Top Level; Part Number: RC0805FR0710KL; Value: 10k; Material: FR-07; qty: 50
R55-R62 = RC0805FR071KL: as R71 on sheet Power Supply; Part Number: RC0805FR071KL; Value: 1k; Material: FR-07; qty: 50
U7 = SN74HC540DWR: as U1 on sheet Dice Module; Part Number: SN74HC540DWR; Digikey Part Number: 296-8333-1-ND; Digikey Link: https://www.digikey.com/product-detail/en/texas-instruments/SN74HC540DWR/296-8333-1-ND/376710
U8 = S16C03-8TR: as U2 on sheet Input Pins; Part Number: S16C03-8TR; Digikey Part Number: 1655-2152-2-ND; Digikey Link: https://www.digikey.com/product-detail/en/smc-diode-solutions/S16C03-8TR/1655-2152-2-ND/9816814

## Sheet Display.SchDoc
size A3
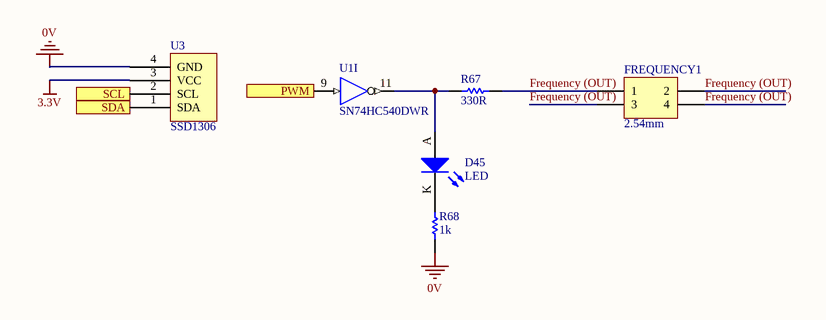
[diagram p8: Display.SchDoc]

### Parts
D45  LED  [0805 LED]
FREQUENCY1  2.54mm  [Header 2x2]
R67  330R  [0805]
R68  1k  [0805]
U1  SN74HC540DWR  [TI 20-SOIC]  (part I of 9)
U3  SSD1306  [IIC 128x32 OLED]

### Ports
PWM, SCL, SDA

### Nets
0V: R68.1 U3.4(GND)
3.3V: U3.3(VCC)
Frequency (OUT): FREQUENCY1.1 FREQUENCY1.2 FREQUENCY1.3 FREQUENCY1.4 R67.2
SCL: U3.2(SCL) ; port SCL
SDA: U3.1(SDA) ; port SDA
NetBRUCE_SPRINGSTEEN1_13: U1.9(A8) ; port PWM
NetD45_A: D45.A R67.1 U1.11(Y8)
NetD45_K: D45.K R68.2

### Library data of the parts
D45 = SML-210LTT86: as ACTIVE1 on sheet Power Supply; Part Number: SML-210LTT86; Colour: Red; Digikey Part Number: 511-1286-1-ND; Digikey Link: https://www.digikey.com/product-detail/en/rohm-semiconductor/SML-210LTT86/511-1286-1-ND/637099
FREQUENCY1 = Header 2x2: as POWER_1 on sheet Power Supply; Part Number: Header 2x2; Pitch: 2.54mm; Row Spacing: 2.54mm
R67 = RC0805FR07330RL: as R23 on sheet Traffic Intersection; Part Number: RC0805FR07330RL; Value: 330R; Material: FR-07; qty: 50
R68 = RC0805FR071KL: as R71 on sheet Power Supply; Part Number: RC0805FR071KL; Value: 1k; Material: FR-07; qty: 50
U1 = SN74HC540DWR: as U1 on sheet Dice Module; Part Number: SN74HC540DWR; Digikey Part Number: 296-8333-1-ND; Digikey Link: https://www.digikey.com/product-detail/en/texas-instruments/SN74HC540DWR/296-8333-1-ND/376710
U3 = SSD1306: AU 0.91" IIC I2C OLED LCD Display Module 128x32 for Arduino PIC SSD1306 3.3V~5V; Part Number: SSD1306; Manufacturer: IIC; Digikey Link: https://www.ebay.com.au/itm/AU-0-91-IIC-I2C-OLED-LCD-Display-Module-128x32-for-Arduino-PIC-SSD1306-3-3V-5V/173740276759?_trkparms=ispr%3D1&hash=item2873ba3c17:m:mtuBFdundu-sO8SF14N9s0Q&enc=AQAEAAACMBPxNw%2BVj6nta7CKEs3N0qXGdDgw5AbtZBK2GBjvTzu8XHiBcI5uLQY2T5XcetHUGO8PuZRarzai%2FQnEDe6BkxUq23f79SyeGX5oa6nluXFEGG0Hz2gFX11EJ6GYaVvL7i6kc6va81t%2FwKg3W0ssZIxhwwMp0Eh%2BfoN3%2FrnYSkd7s7YclAfVoAj%2BaE2AwEV5QVm85FaIjCJvvMHeJfphryi2paEsyevtRWBIghk8SFidXOvhtC5GCTPSeR9JXfeRjZVxl7mexAnG4x8z49OuYCtQWuXZ9QNvOo3RMcMk%2F5bSItT0RwsIG0jBwvLODPvisKQIMwRXM3MwGj9yzOyOZYIdpSvnofANN%2Fg9hrlJjeHKizw4Ga6LAey%2BlexpCRBABzUaVccJco2%2FpVNKV1UVGCKL5zr4%2BwfYHs3IhPQhs65tz9jQnmL6CNZlKVyXJoCkgaVFgwBlkVflMYXL%2BQ6ywD4h3STo%2FCt3NyZDCdseYf54DzEjZBuIFx9YEq5QtoLI1kcGm1pkCFMvpRESH1WvSd%2FgKEiZ8Xf%2FKWTNYoiWh5m%2B%2BiQiSwxthHjU08rIAcRCZgCaKv35l0XRTQIvsqBsEvCN18uoS38NBw5YpFlkSUvSRdNi1QRiSdeRE0SvVLNR2j1ewKdsSHUlME7ra59o1zZ5%2FQh633FqSubhH0lMpD%2FWH%2B%2F9jRhKc0S%2BULy7rnlhuKVSUd%2BeIjdIOrTIRkWcIYPrX11YwluhIJrHwWBB4uET&checksum=17374027675912d05a9cae6e455683321d2000ae08a5&enc=AQAEAAACMBPxNw%2BVj6nta7CKEs3N0qXGdDgw5AbtZBK2GBjvTzu8XHiBcI5uLQY2T5XcetHUGO8PuZRarzai%2FQnEDe6BkxUq23f79SyeGX5oa6nluXFEGG0Hz2gFX11EJ6GYaVvL7i6kc6va81t%2FwKg3W0ssZIxhwwMp0Eh%2BfoN3%2FrnYSkd7s7YclAfVoAj%2BaE2AwEV5QVm85FaIjCJvvMHeJfphryi2paEsyevtRWBIghk8SFidXOvhtC5GCTPSeR9JXfeRjZVxl7mexAnG4x8z49OuYCtQWuXZ9QNvOo3RMcMk%2F5bSItT0RwsIG0jBwvLODPvisKQIMwRXM3MwGj9yzOyOZYIdpSvnofANN%2Fg9hrlJjeHKizw4Ga6LAey%2BlexpCRBABzUaVccJco2%2FpVNKV1UVGCKL5zr4%2BwfYHs3IhPQhs65tz9jQnmL6CNZlKVyXJoCkgaVFgwBlkVflMYXL%2BQ6ywD4h3STo%2FCt3NyZDCdseYf54DzEjZBuIFx9YEq5QtoLI1kcGm1pkCFMvpRESH1WvSd%2FgKEiZ8Xf%2FKWTNYoiWh5m%2B%2BiQiSwxthHjU08rIAcRCZgCaKv35l0XRTQIvsqBsEvCN18uoS38NBw5YpFlkSUvSRdNi1QRiSdeRE0SvVLNR2j1ewKdsSHUlME7ra59o1zZ5%2FQh633FqSubhH0lMpD%2FWH%2B%2F9jRhKc0S%2BULy7rnlhuKVSUd%2BeIjdIOrTIRkWcIYPrX11YwluhIJrHwWBB4uET&checksum=17374027675912d05a9cae6e455683321d2000ae08a5&frcectupt=true

## Sheet The Fun Buttons' Friends.SchDoc
size A4
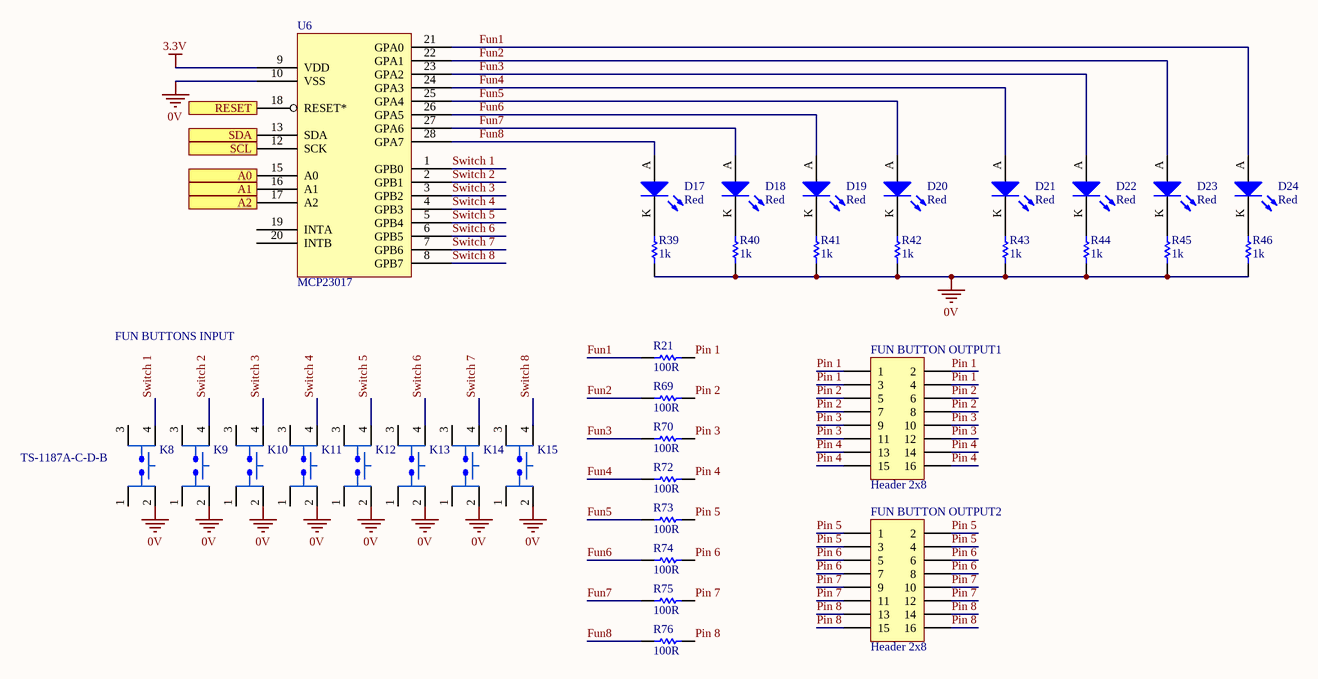
[diagram p9: The Fun Buttons' Friends.SchDoc]

### Parts
D17  Red  [0805 LED]
D18  Red  [0805 LED]
D19  Red  [0805 LED]
D20  Red  [0805 LED]
D21  Red  [0805 LED]
D22  Red  [0805 LED]
D23  Red  [0805 LED]
D24  Red  [0805 LED]
FUN_BUTTON_OUTPUT1  Header 2x8  [Header 2x8]
FUN_BUTTON_OUTPUT2  Header 2x8  [Header 2x8]
K8  TS-1187A-C-D-B  [XKB SW-4.5]
K9  TS-1187A-C-D-B  [XKB SW-4.5]  (value not drawn)
K10  TS-1187A-C-D-B  [XKB SW-4.5]  (value not drawn)
K11  TS-1187A-C-D-B  [XKB SW-4.5]  (value not drawn)
K12  TS-1187A-C-D-B  [XKB SW-4.5]  (value not drawn)
K13  TS-1187A-C-D-B  [XKB SW-4.5]  (value not drawn)
K14  TS-1187A-C-D-B  [XKB SW-4.5]  (value not drawn)
K15  TS-1187A-C-D-B  [XKB SW-4.5]  (value not drawn)
R21  100R  [0805]
R39  1k  [0805]
R40  1k  [0805]
R41  1k  [0805]
R42  1k  [0805]
R43  1k  [0805]
R44  1k  [0805]
R45  1k  [0805]
R46  1k  [0805]
R69  100R  [0805]
R70  100R  [0805]
R72  100R  [0805]
R73  100R  [0805]
R74  100R  [0805]
R75  100R  [0805]
R76  100R  [0805]
U6  MCP23017  [Microchip 28-SOIC]

### Ports
A0, A1, A2, RESET, SCL, SDA

### Nets
0V: K8.2(VDD) K9.2(VDD) K10.2(VDD) K11.2(VDD) K12.2(VDD) K13.2(VDD) K14.2(VDD) K15.2(VDD) R39.1 R40.1 R41.1 R42.1 R43.1 R44.1 R45.1 R46.1 U6.10(VSS) U6.15(A0) U6.16(A1) U6.17(A2) ; port A0, port A1, port A2
3.3V: U6.9(VDD) U6.18(RESET*) ; port RESET
Fun1: D24.A R21.1 U6.21(GPA0)
Fun2: D23.A R69.1 U6.22(GPA1)
Fun3: D22.A R70.1 U6.23(GPA2)
Fun4: D21.A R72.1 U6.24(GPA3)
Fun5: D20.A R73.1 U6.25(GPA4)
Fun6: D19.A R74.1 U6.26(GPA5)
Fun7: D18.A R75.1 U6.27(GPA6)
Fun8: D17.A R76.1 U6.28(GPA7)
Pin 1: FUN_BUTTON_OUTPUT1.1 FUN_BUTTON_OUTPUT1.2 FUN_BUTTON_OUTPUT1.3 FUN_BUTTON_OUTPUT1.4 R21.2
Pin 2: FUN_BUTTON_OUTPUT1.5 FUN_BUTTON_OUTPUT1.6 FUN_BUTTON_OUTPUT1.7 FUN_BUTTON_OUTPUT1.8 R69.2
Pin 3: FUN_BUTTON_OUTPUT1.9 FUN_BUTTON_OUTPUT1.10 FUN_BUTTON_OUTPUT1.11 FUN_BUTTON_OUTPUT1.12 R70.2
Pin 4: FUN_BUTTON_OUTPUT1.13 FUN_BUTTON_OUTPUT1.14 FUN_BUTTON_OUTPUT1.15 FUN_BUTTON_OUTPUT1.16 R72.2
Pin 5: FUN_BUTTON_OUTPUT2.1 FUN_BUTTON_OUTPUT2.2 FUN_BUTTON_OUTPUT2.3 FUN_BUTTON_OUTPUT2.4 R73.2
Pin 6: FUN_BUTTON_OUTPUT2.5 FUN_BUTTON_OUTPUT2.6 FUN_BUTTON_OUTPUT2.7 FUN_BUTTON_OUTPUT2.8 R74.2
Pin 7: FUN_BUTTON_OUTPUT2.9 FUN_BUTTON_OUTPUT2.10 FUN_BUTTON_OUTPUT2.11 FUN_BUTTON_OUTPUT2.12 R75.2
Pin 8: FUN_BUTTON_OUTPUT2.13 FUN_BUTTON_OUTPUT2.14 FUN_BUTTON_OUTPUT2.15 FUN_BUTTON_OUTPUT2.16 R76.2
SCL: U6.12(SCK) ; port SCL
SDA: U6.13(SDA) ; port SDA
Switch 1: K8.4(VDD) U6.1(GPB0)
Switch 2: K9.4(VDD) U6.2(GPB1)
Switch 3: K10.4(VDD) U6.3(GPB2)
Switch 4: K11.4(VDD) U6.4(GPB3)
Switch 5: K12.4(VDD) U6.5(GPB4)
Switch 6: K13.4(VDD) U6.6(GPB5)
Switch 7: K14.4(VDD) U6.7(GPB6)
Switch 8: K15.4(VDD) U6.8(GPB7)
NetD17_K: D17.K R39.2
NetD18_K: D18.K R40.2
NetD19_K: D19.K R41.2
NetD20_K: D20.K R42.2
NetD21_K: D21.K R43.2
NetD22_K: D22.K R44.2
NetD23_K: D23.K R45.2
NetD24_K: D24.K R46.2

Not connected (* = marked no-connect by the designer): K8 1(VDD) 3(VDD); K9 1(VDD) 3(VDD); K10 1(VDD) 3(VDD); K11 1(VDD) 3(VDD); K12 1(VDD) 3(VDD); K13 1(VDD) 3(VDD); K14 1(VDD) 3(VDD); K15 1(VDD) 3(VDD); U6 19(INTA) 20(INTB)

### Notes on the sheet
- FUN BUTTONS INPUT
- Title
- Size:
- Date:
- A4
- Number:
- Time:
- Revision:
- Sheet
- of
- File:

### Library data of the parts
D17-D24 = SML-210LTT86: as ACTIVE1 on sheet Power Supply; Part Number: SML-210LTT86; Colour: Red; Digikey Part Number: 511-1286-1-ND; Digikey Link: https://www.digikey.com/product-detail/en/rohm-semiconductor/SML-210LTT86/511-1286-1-ND/637099
FUN_BUTTON_OUTPUT1 FUN_BUTTON_OUTPUT2 = Header 2x8: as LIGHTS_INPUT1 on sheet The Lights; Part Number: Header 2x8; Row Spacing: 2.54mm
K8-K15 = TS-1187A-C-D-B: as K1 on sheet Input Buttons; Part Number: TS-1187A-C-D-B; Digikey Link: https://jlcpcb.com/client/index.html#/parts/componentSearch?searchTxt=usb
R21 R69 R70 R72-R76 = RC0805FR07100RL: Manufacturer: YAGEO; Tolerance: 0.01; Rated Voltage: 0.125W; Part Number: RC0805FR07100RL; Value: 100R; Material: FR-07; qty: 50
R39-R46 = RC0805FR071KL: as R71 on sheet Power Supply; Part Number: RC0805FR071KL; Value: 1k; Material: FR-07; qty: 50
U6 = MCP23017: as TRAFFIC_EXPANDER1 on sheet Traffic Intersection; Part Number: MCP23017; Digikey Part Number: MCP23017T-E/SOTR-ND; Digikey Link: https://www.digikey.com/product-detail/en/microchip-technology/MCP23017T-E-SO/MCP23017T-E-SOTR-ND/964184

## Sheet Stepper Motor.SchDoc
size A4
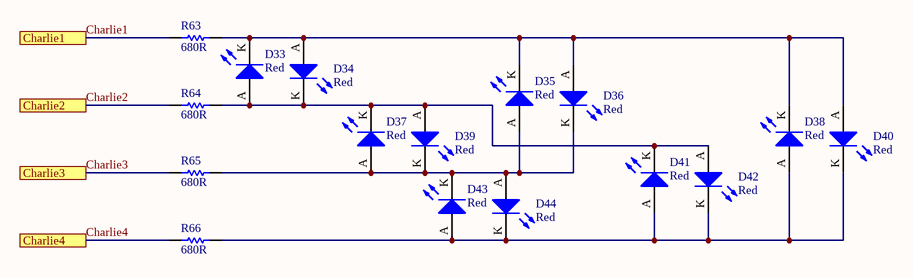
[diagram p10: Stepper Motor.SchDoc]

### Parts
D33  Red  [0805 LED]
D34  Red  [0805 LED]
D35  Red  [0805 LED]
D36  Red  [0805 LED]
D37  Red  [0805 LED]
D38  Red  [0805 LED]
D39  Red  [0805 LED]
D40  Red  [0805 LED]
D41  Red  [0805 LED]
D42  Red  [0805 LED]
D43  Red  [0805 LED]
D44  Red  [0805 LED]
R63  680R  [0805]
R64  680R  [0805]
R65  680R  [0805]
R66  680R  [0805]

### Ports
Charlie1, Charlie2, Charlie3, Charlie4

### Nets
Charlie1: R63.2 ; port Charlie1
Charlie2: R64.2 ; port Charlie2
Charlie3: R65.2 ; port Charlie3
Charlie4: R66.2 ; port Charlie4
NetD33_A: D33.A D34.K D37.K D39.A D41.K D42.A R64.1
NetD33_K: D33.K D34.A D35.K D36.A D38.K D40.A R63.1
NetD35_A: D35.A D36.K D37.A D39.K D43.K D44.A R65.1
NetD38_A: D38.A D40.K D41.A D42.K D43.A D44.K R66.1

### Notes on the sheet
- Title
- Size:
- Date:
- A4
- Number:
- Time:
- Revision:
- Sheet
- of
- File:

### Library data of the parts
D33-D44 = SML-210LTT86: as ACTIVE1 on sheet Power Supply; Part Number: SML-210LTT86; Colour: Red; Digikey Part Number: 511-1286-1-ND; Digikey Link: https://www.digikey.com/product-detail/en/rohm-semiconductor/SML-210LTT86/511-1286-1-ND/637099
R63-R66 = RC0805FR07680RL: as R28 on sheet Traffic Intersection; Part Number: RC0805FR07680RL; Value: 680R; Material: FR-07; qty: 50

## Nets that join several sheets
0V: Power Supply (17 pins), Input Buttons (7 pins), Input Pins (8 pins), Microcontroller (10 pins), Traffic Intersection (19 pins), Dice Module (11 pins), The Lights (19 pins), Display (R68.1 U3.4), The Fun Buttons' Friends (20 pins)
3.3V: 190822 Top Level (R1.1 R2.1), Power Supply (7 pins), Microcontroller (7 pins), Traffic Intersection (TRAFFIC_EXPANDER1.9 TRAFFIC_EXPANDER1.15 TRAFFIC_EXPANDER1.18), Dice Module (8 pins), The Lights (9 pins), Display (U3.3), The Fun Buttons' Friends (U6.9 U6.18)
5V: Power Supply (6 pins), Microcontroller (ICSP1.2)
Charlie1: Microcontroller (BRUCE_SPRINGSTEEN1.17 ICSP1.3), Stepper Motor (R63.2)
Charlie2: Microcontroller (BRUCE_SPRINGSTEEN1.23), Stepper Motor (R64.2)
Charlie3: Microcontroller (BRUCE_SPRINGSTEEN1.24), Stepper Motor (R65.2)
Charlie4: Microcontroller (BRUCE_SPRINGSTEEN1.25), Stepper Motor (R66.2)
MISO: Input Pins (R16.2 STEPPER_INPUT1.3 STEPPER_INPUT1.4 U2.10), Microcontroller (BRUCE_SPRINGSTEEN1.16 ICSP1.1)
MOSI: Input Pins (R17.2 STEPPER_INPUT1.1 STEPPER_INPUT1.2 U2.9), Microcontroller (BRUCE_SPRINGSTEEN1.15 ICSP1.4)
NetBRUCE_SPRINGSTEEN1_1: Input Buttons (K6.4), Microcontroller (BRUCE_SPRINGSTEEN1.1)
NetBRUCE_SPRINGSTEEN1_2: Input Buttons (K3.4), Microcontroller (BRUCE_SPRINGSTEEN1.2)
NetBRUCE_SPRINGSTEEN1_9: Input Buttons (K4.4), Microcontroller (BRUCE_SPRINGSTEEN1.9)
NetBRUCE_SPRINGSTEEN1_10: Input Buttons (K1.4), Microcontroller (BRUCE_SPRINGSTEEN1.10)
NetBRUCE_SPRINGSTEEN1_11: Input Buttons (K2.4), Microcontroller (BRUCE_SPRINGSTEEN1.11)
NetBRUCE_SPRINGSTEEN1_13: Microcontroller (BRUCE_SPRINGSTEEN1.13), Display (U1.9)
NetBRUCE_SPRINGSTEEN1_30: Input Buttons (K5.4), Microcontroller (BRUCE_SPRINGSTEEN1.30)
NetBRUCE_SPRINGSTEEN1_32: Input Buttons (K7.4), Microcontroller (BRUCE_SPRINGSTEEN1.32)
SCL: 190822 Top Level (R1.2), Microcontroller (BRUCE_SPRINGSTEEN1.28), Traffic Intersection (TRAFFIC_EXPANDER1.12), Display (U3.2), The Fun Buttons' Friends (U6.12)
SDA: 190822 Top Level (R2.2), Microcontroller (BRUCE_SPRINGSTEEN1.27), Traffic Intersection (TRAFFIC_EXPANDER1.13), Display (U3.1), The Fun Buttons' Friends (U6.13)
Stepper A (IN): Input Pins (R14.2 STEPPER_INPUT1.7 STEPPER_INPUT1.8 U2.12), Microcontroller (BRUCE_SPRINGSTEEN1.12)
Stepper B (IN): Input Pins (R15.2 STEPPER_INPUT1.5 STEPPER_INPUT1.6 U2.11), Microcontroller (BRUCE_SPRINGSTEEN1.14)